# Altium schematic sheet ID.SchDoc
size A4
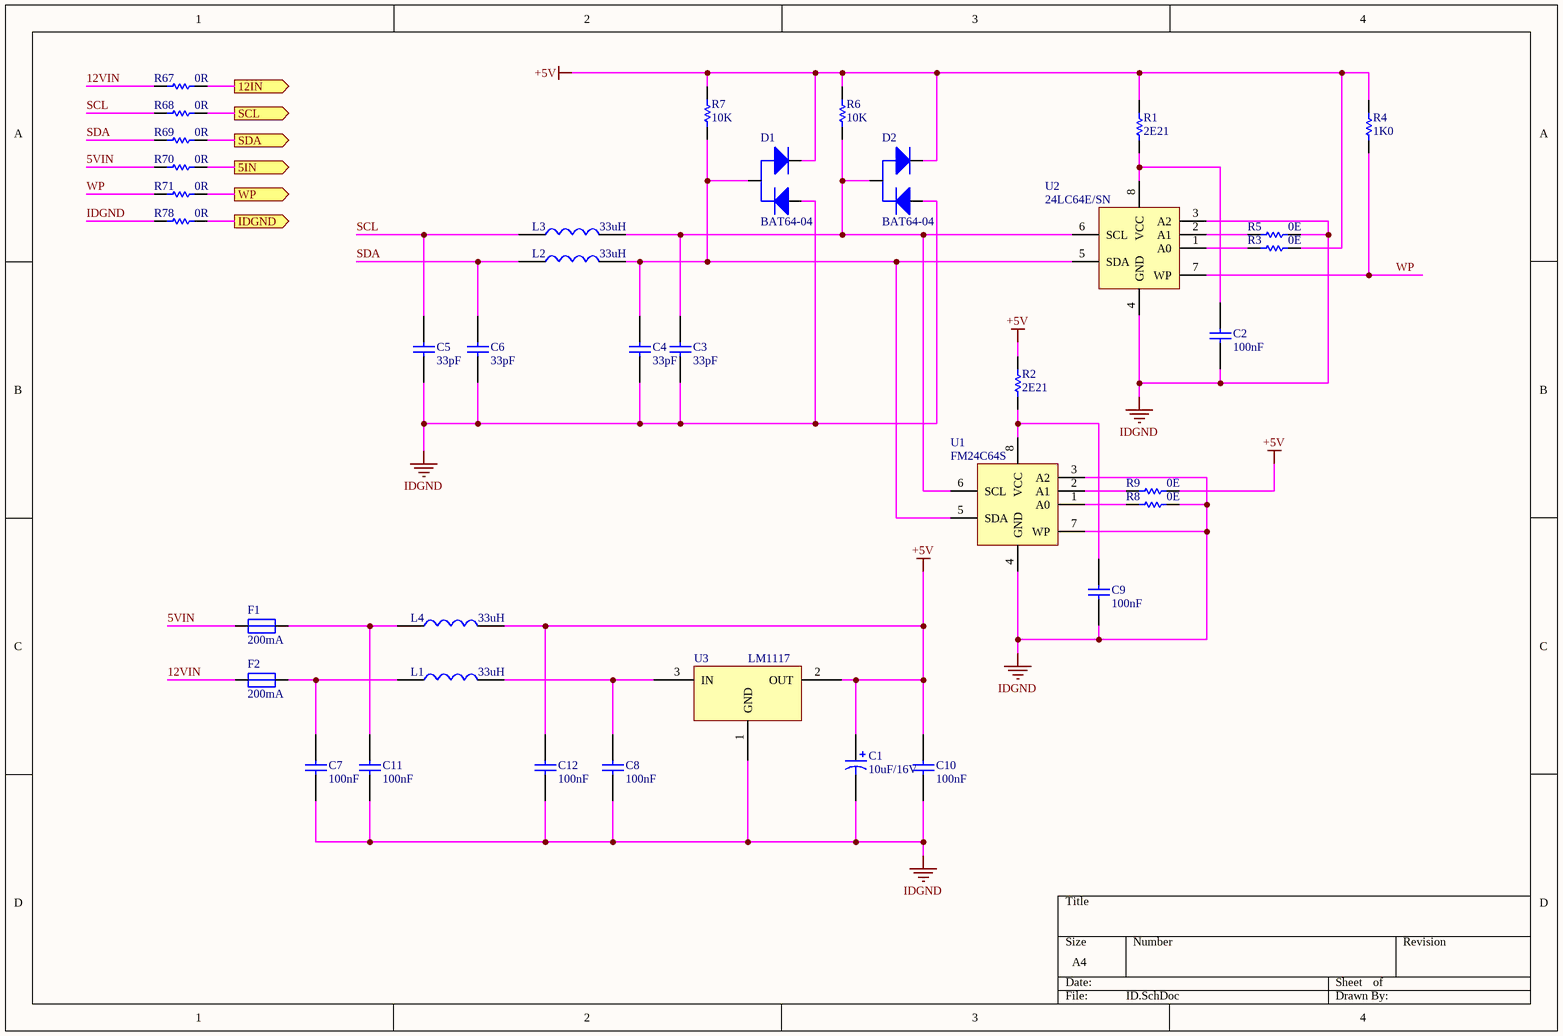
[diagram p0: ID.SchDoc]

## Parts
C1  10uF/16V  [7343-CAP]
C2  100nF  [0603INCH_1608mm]
C3  33pF  [0603INCH_1608mm]
C4  33pF  [0603INCH_1608mm]
C5  33pF  [0603INCH_1608mm]
C6  33pF  [0603INCH_1608mm]
C7  100nF  [0603INCH_1608mm]
C8  100nF  [0603INCH_1608mm]
C9  100nF  [0603INCH_1608mm]
C10  100nF  [0603INCH_1608mm]
C11  100nF  [0603INCH_1608mm]
C12  100nF  [0603INCH_1608mm]
D1  BAT64-04  [SOT23_N]
D2  BAT64-04  [SOT23_N]
F1  200mA  [Fuse]
F2  200mA  [Fuse]
L1  33uH  [3216 Chip]
L2  33uH  [3216 Chip]
L3  33uH  [3216 Chip]
L4  33uH  [3216 Chip]
R1  2E21  [0603INCH_1608mm]
R2  2E21  [0603INCH_1608mm]
R3  0E  [0603INCH_1608mm]
R4  1K0  [0603INCH_1608mm]
R5  0E  [0603INCH_1608mm]
R6  10K  [0603INCH_1608mm]
R7  10K  [0603INCH_1608mm]
R8  0E  [0603INCH_1608mm]
R9  0E  [0603INCH_1608mm]
R67  0R  [0603INCH_1608mm]
R68  0R  [0603INCH_1608mm]
R69  0R  [0603INCH_1608mm]
R70  0R  [0603INCH_1608mm]
R71  0R  [0603INCH_1608mm]
R78  0R  [0603INCH_1608mm]
U1  FM24C64S  [SOIC127P600-8M]
U2  24LC64E/SN  [SOIC127P600-8M]
U3  LM1117  [SOT223]

## Ports
5IN (out), 12IN (out), IDGND (out), SCL (out), SDA (out), WP (out)

## Nets
+5V: C1.1 C10.2 C12.2 D1.2 D2.2 L4.2 R1.2 R2.2 R3.2 R4.2 R6.2 R7.2 R9.2 U3.2(OUT)
IDGND: C1.2 C2.1 C3.1 C4.1 C5.1 C6.1 C7.1 C8.1 C9.1 C10.1 C11.1 C12.1 D1.1 D2.1 R5.2 R8.2 R78.1 U1.3(A2) U1.4(GND) U1.7(WP) U2.3(A2) U2.4(GND) U3.1(GND)
5IN: R70.2 ; port 5IN
5VIN: F1.1 R70.1
12IN: R67.2 ; port 12IN
12VIN: F2.1 R67.1
IDGND: R78.2 ; port IDGND  [a separate net that carries the same name]
SCL: R68.2 ; port SCL
SCL: C5.2 L3.1 R68.1  [a separate net that carries the same name]
SDA: R69.2 ; port SDA
SDA: C6.2 L2.1 R69.1  [a separate net that carries the same name]
WP: R71.2 ; port WP
WP: R4.1 R71.1 U2.7(WP)  [a separate net that carries the same name]
NetC2_2: C2.2 R1.1 U2.8(VCC)
NetC3_2: C3.2 D2.3 L3.2 R6.1 U1.6(SCL) U2.6(SCL)
NetC4_2: C4.2 D1.3 L2.2 R7.1 U1.5(SDA) U2.5(SDA)
NetC7_2: C7.2 F2.2 L1.1
NetC8_2: C8.2 L1.2 U3.3(IN)
NetC9_2: C9.2 R2.1 U1.8(VCC)
NetC11_2: C11.2 F1.2 L4.1
NetR3_1: R3.1 U2.1(A0)
NetR5_1: R5.1 U2.2(A1)
NetR8_1: R8.1 U1.1(A0)
NetR9_1: R9.1 U1.2(A1)

Not connected (* = marked no-connect by the designer): U3 4

## Library data of the parts
C1 = Cap_Pol: Value: 100pF
C2-C12 = Cap: Value: 100pF
F1 F2 = Fuse
L1-L4 = Inductor
R1-R9 R67-R71 R78 = Res: Value: 1K
U1 U2 = IIC Mem
U3 = 7805